# EAGLE design Display (EAGLE 7.1.0)
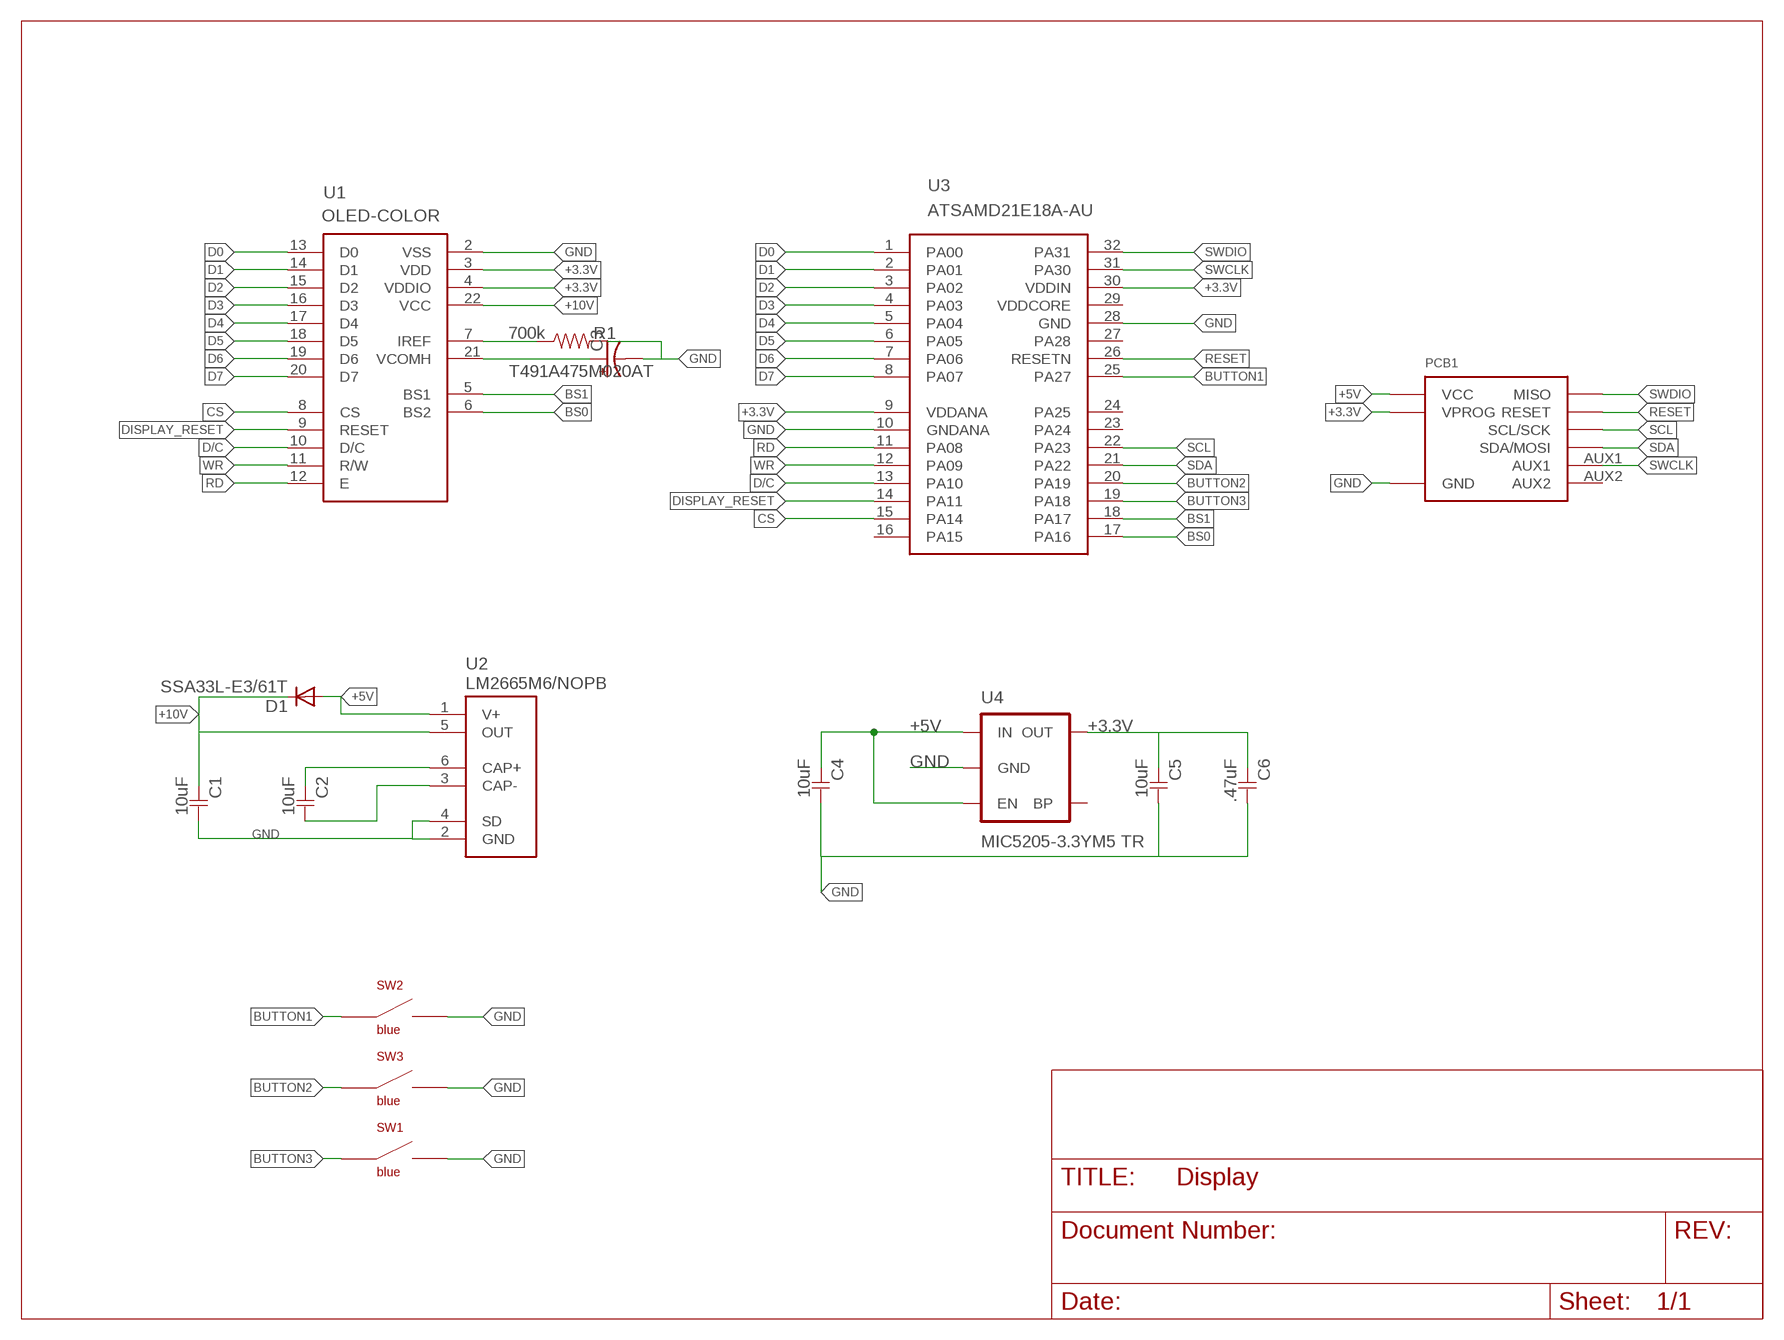
[diagram p0: schematic, sheet 1]

## Parts
C1  10uF  CAPACITOR  [0805]
C2  10uF  CAPACITOR  [0805]
C3  T491A475M020AT  10UF-16V-10%(TANT)  [EIA3216]
C4  10uF  CAPACITOR  [0805]
C5  10uF  CAPACITOR  [0805]
C6  .47uF  CAPACITOR  [0805]
D1  SSA33L-E3/61T  DIODESMA  [SMA-DIODE]
PCB1  MAGDEVICE-V2-OLED  [MAGDEVICE-V2-OLED]
R1  700k  RESISTOR  [0805]
SW1  blue  SWITCHBOURNS-7914J  [BOURNS-7914J]
SW2  blue  SWITCHBOURNS-7914J  [BOURNS-7914J]
SW3  blue  SWITCHBOURNS-7914J  [BOURNS-7914J]
U1  OLED-COLOR  [FPC-24]
U2  LM2665M6/NOPB  LM2665  [SOT-26]
U3  ATSAMD21E18A-AU  SAMD21E  [TQFP-32]
U4  MIC5205-3.3YM5 TR  VREG-MIC5205-3.3V  [SOT23-5]

## Nets
+3.3V: C5.1 C6.1 PCB1.VPROG U1.3(VDD) U1.4(VDDIO) U3.9(VDDANA) U3.30(VDDIN) U4.5(OUT)
+5V: C4.1 D1.A PCB1.VCC U2.1(V+) U4.1(IN) U4.3(EN)
+10V: C1.1 D1.C U1.22(VCC) U2.5(OUT)
BS0: U1.6(BS2) U3.17(PA16)
BS1: U1.5(BS1) U3.18(PA17)
BUTTON1: SW2.POS$1(POS1) SW2.POS$2(POS1) U3.25(PA27)
BUTTON2: SW3.POS$1(POS1) SW3.POS$2(POS1) U3.20(PA19)
BUTTON3: SW1.POS$1(POS1) SW1.POS$2(POS1) U3.19(PA18)
CS: U1.8(CS) U3.15(PA14)
D0: U1.13(D0) U3.1(PA00)
D1: U1.14(D1) U3.2(PA01)
D2: U1.15(D2) U3.3(PA02)
D3: U1.16(D3) U3.4(PA03)
D4: U1.17(D4) U3.5(PA04)
D5: U1.18(D5) U3.6(PA05)
D6: U1.19(D6) U3.7(PA06)
D7: U1.20(D7) U3.8(PA07)
D/C: U1.10(D/C) U3.13(PA10)
DISPLAY_RESET: U1.9(RESET) U3.14(PA11)
GND: C1.2 C3.C(-) C4.2 C5.2 C6.2 PCB1.GND R1.2 SW1.NEG$1(NEG1) SW1.NEG$2(NEG1) SW2.NEG$1(NEG1) SW2.NEG$2(NEG1) SW3.NEG$1(NEG1) SW3.NEG$2(NEG1) U1.2(VSS) U2.2(GND) U2.4(SD) U3.10(GNDANA) U3.28(GND) U4.2(GND)
N$5: C3.A(+) U1.21(VCOMH)
N$8: R1.1 U1.7(IREF)
N$13: C2.1 U2.6(CAP+)
N$14: C2.2 U2.3(CAP-)
RD: U1.12(E) U3.11(PA08)
RESET: PCB1.RESET U3.26(RESETN)
SCL: PCB1.SCL(SCL/SCK) U3.22(PA23)
SDA: PCB1.SDA(SDA/MOSI) U3.21(PA22)
SWCLK: PCB1.AUX1 U3.31(PA30)
SWDIO: PCB1.MISO U3.32(PA31)
WR: U1.11(R/W) U3.12(PA09)
Unconnected: PCB1.AUX2 U3.16(PA15) U3.23(PA24) U3.24(PA25) U3.27(PA28) U3.29(VDDCORE) U4.4(BP)

## Library data of the parts
C1 C2 C4-C6 = Modulo:CAPACITOR: Capacitor
C3 = SparkFun-Capacitors:10UF-16V-10%(TANT): CAP-00811 1206/EIA-3216 Tantalum capacitor; PROD_ID: CAP-00811; VALUE: 10uF
D1 = SparkFun-DiscreteSemi:DIODE: Diode These are standard reverse protection diodes and small signal diodes. SMA package can handle up to about 1A. SOD-323 can handle about 200mA. What the SOD-323 package when ordering, there are some mfgs out there that are 5-pin packages.
PCB1 = Modulo:MAGDEVICE; BOARD: Display; VERSION: 2
R1 = Modulo:RESISTOR: Resistor Basic schematic elements and footprints for 0603, 1206, and PTH resistors.
SW1-SW3 = Modulo:SWITCH; PARTNUM: 7914J-1-000E
U1 = Modulo:OLED-COLOR; SUPPLIER: buydisplay.com
U2 = Modulo:LM2665
U3 = Modulo:SAMD21E
U4 = Modulo:VREG-MIC5205: V_REG MIC5219 Standard 3.3V and 5V 150mA LDO voltage regulator in SOT-23 layout. Micrel part MIC5205. BP (by-pass) pin is used to lower output noise with 470pF cap, may be left open.

## Board
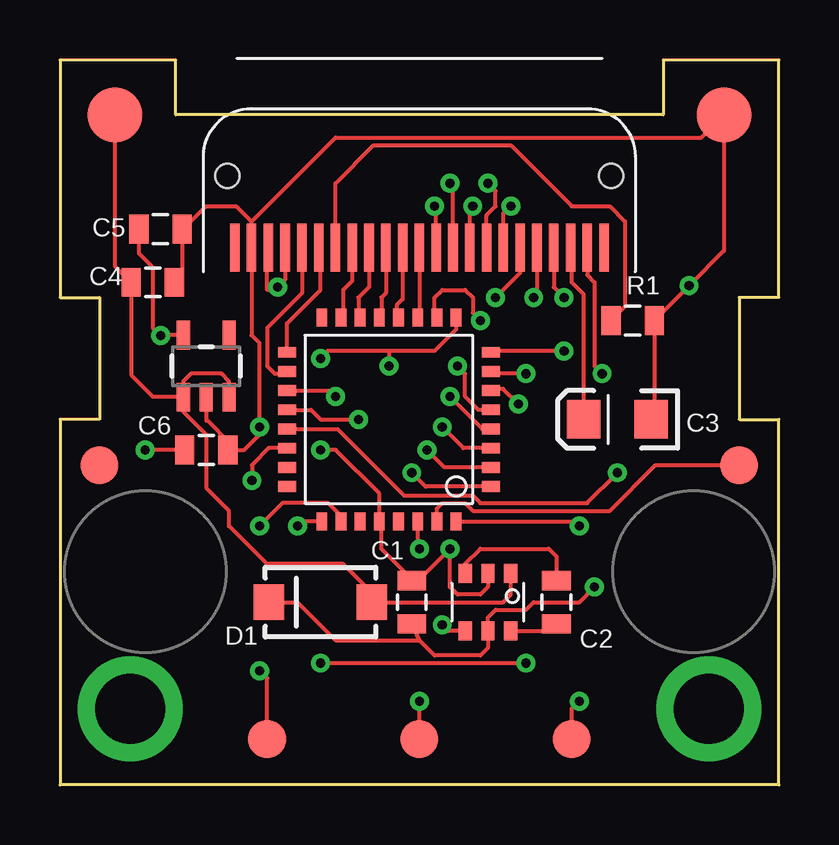
[diagram p1: board, top side]
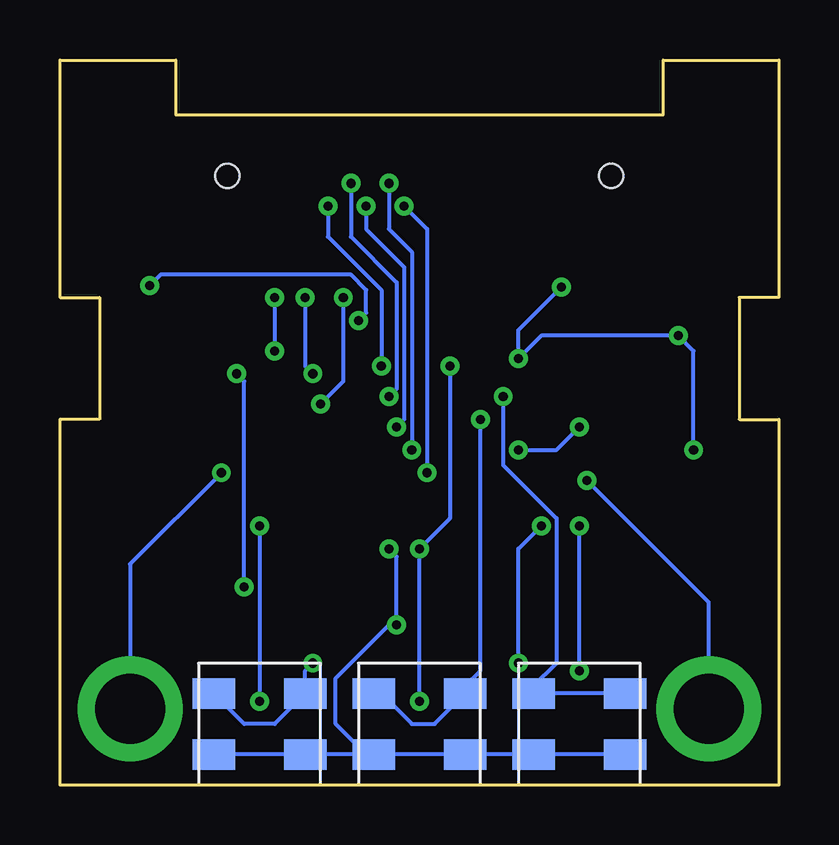
[diagram p2: board, bottom side, seen from below]

Size 29.97 x 30.23 mm. Coordinates in mm from the lower left corner, seen from the top.
Copper layers (1*16): Top 0.0178mm / dielectric 59mil / Bottom 0.0178mm
Design rules "SSC-EAGLE-2Lyr_v1.0.0.3": minimum track width 6mil, minimum drill 14mil, track to track 6mil, track to pad 6mil, pad to pad 6mil, via to via 6mil, smd to smd 6mil, copper to edge 20mil, drill to drill 16mil, minimum pad ring 8mil, minimum via ring 8mil, stop-mask expansion 3mil, vias tented up to drill 0mil, thermal gap 10mil

### Footprints (pad centres in the part's own frame; a part is rotated, then mirrored left to right if it is on the bottom)
0805 = smd 0.8 x 1.2: 1 -0.9,0; 2 0.9,0
EIA3216 = smd 1.4 x 1.6: A 1.4,0; C -1.4,0
SMA-DIODE = smd 1.27 x 1.47: A -2.15,0; C 2.15,0
MAGDEVICE-V2-OLED = smd 1.587 x 1.587 bottom: AUX1 1.905,13.335; AUX2 28.575,13.335; MISO 8.89,1.905; RESET 21.59,1.905; VPROG 15.24,1.905 | smd 2.286 x 2.286 bottom: GND 2.54,27.94; VCC 27.94,27.94 | drill 2.921: SCL 27.305,3.175; SDA 3.175,3.175
BOURNS-7914J = smd 1.27 x 1.778: NEG$1 1.27,1.905; NEG$2 1.27,-1.905; POS$1 -1.27,1.905; POS$2 -1.27,-1.905
FPC-24 = smd 0.4 x 2: 1 -7.7,1; 2 -7,1; 3 -6.3,1; 4 -5.6,1; 5 -4.9,1; 6 -4.2,1; 7 -3.5,1; 8 -2.8,1; 9 -2.1,1; 10 -1.4,1; 11 -0.7,1; 12 0,1; 13 0.7,1; 14 1.4,1; 15 2.1,1; 16 2.8,1; 17 3.5,1; 18 4.2,1; 19 4.9,1; 20 5.6,1; 21 6.3,1; 22 7,1; 23 7.7,1 | hole 1: -8,4; 8,4
SOT-26 = smd 0.55 x 0.8: 1 -0.95,-1.2; 2 0,-1.2; 3 0.95,-1.2; 4 0.95,1.2; 5 0,1.2; 6 -0.95,1.2
TQFP-32 = smd 0.75 x 0.45: 1 -4.25,2.8; 2 -4.25,2; 3 -4.25,1.2; 4 -4.25,0.4; 5 -4.25,-0.4; 6 -4.25,-1.2; 7 -4.25,-2; 8 -4.25,-2.8; 17 4.25,-2.8; 18 4.25,-2; 19 4.25,-1.2; 20 4.25,-0.4; 21 4.25,0.4; 22 4.25,1.2; 23 4.25,2; 24 4.25,2.8 | smd 0.45 x 0.75: 9 -2.8,-4.25; 10 -2,-4.25; 11 -1.2,-4.25; 12 -0.4,-4.25; 13 0.4,-4.25; 14 1.2,-4.25; 15 2,-4.25; 16 2.8,-4.25; 25 2.8,4.25; 26 2,4.25; 27 1.2,4.25; 28 0.4,4.25; 29 -0.4,4.25; 30 -1.2,4.25; 31 -2,4.25; 32 -2.8,4.25
SOT23-5 = smd 0.55 x 1.2: 1 -0.95,-1.3; 2 0,-1.3; 3 0.95,-1.3; 4 0.95,1.3; 5 -0.95,1.3

### Placement (x,y rotation side)
C1  14.67,7.62 90 top
C2  20.7,7.62 90 top
C3  23.24,15.24 180 top
C4  3.87,20.95 0 top
C5  4.19,23.18 0 top
C6  6.1,13.97 0 top
D1  10.86,7.62 180 top
PCB1  30.23,0 0 bottom
R1  23.88,19.37 0 top
SW1  8.32,2.54 270 bottom
SW2  21.65,2.54 270 bottom
SW3  14.99,2.54 270 bottom
U1  14.99,21.4 0 top
U2  17.84,7.62 180 top
U3  13.72,15.24 180 top
U4  6.1,17.46 0 top

### Tracks (layer width: path | path; a pad name or v marks a point on that pad's centre or on a via)
+3.3V  (via drill 0.38)
  Top 0.159: U1.4 9.39,21.07 v9.07,20.75 8.95,20.64 8.64,20.64 8.64,22.35 U1.3 | U3.9 16.52,18.99 15.62,18.1 13.72,18.1 | 13.72,18.1 11.18,18.1 v10.86,17.78 | U4.5 4.22,18.76 v4.19,18.73 3.87,19.05 3.87,21.59 3.29,22.17 C5.1 | C6.1 v3.56,13.97 | PCB1.VPROG v14.99,3.49 | U3.30 14.92,9.91 v14.99,9.84 | 13.72,18.1 v13.72,17.46
  Bottom 0.159: v9.07,20.75 10.86,18.96 v10.86,17.78 9.91,18.73 v4.19,18.73 3.56,18.1 v3.56,13.97 | v14.99,3.49 v14.99,9.84 13.72,11.11 v13.72,17.46
+5V
  Top 0.159: PCB1.VCC 2.29,21.64 C4.1 2.97,17.09 3.87,16.19 5.12,16.19 U4.1 | U4.3 7.05,16.83 6.73,17.14 5.46,17.14 5.14,16.83 U4.1 | U4.1 5.15,15.55 6.1,14.61 6.1,12.38 7.05,11.43 7.05,10.79 8.64,9.21 11.81,9.21 13.01,8.01 D1.A 18.48,7.62 18.8,7.94 U2.1
+10V  (via drill 0.38)
  Top 0.159: U1.22 21.99,21.26 22.29,20.95 22.29,17.46 v22.61,17.14 | 14.99,6.03 15.62,5.4 17.53,5.4 17.84,5.71 U2.5 17.84,6.99 18.16,7.3 19.43,7.3 19.75,7.62 21.65,7.62 v22.29,8.26 | 14.99,6.03 C1.1 | D1.C 9.91,7.62 11.49,6.03 14.99,6.03
  Bottom 0.159: v22.29,8.26 22.29,16.83 v22.61,17.14
BS0
  Top 0.159: U3.17 9.47,19.25 10.86,20.64 10.86,22.33 U1.6
BS1
  Top 0.159: U1.5 10.09,20.5 8.64,19.05 8.64,17.46 8.95,17.14 9.37,17.14 U3.18
BUTTON1  (via drill 0.38)
  Top 0.159: v19.43,5.08 v10.86,5.08 | U3.25 10.1,10.99 v9.91,10.79
  Bottom 0.159: SW2.POS$2 22.29,2.54 21.02,2.54 SW2.POS$1 19.75,4.76 v19.43,5.08 | v10.86,5.08 10.86,9.84 v9.91,10.79
BUTTON2  (via drill 0.38)
  Top 0.159: U3.20 10.46,15.64 10.86,15.24 v12.45,15.24
  Bottom 0.159: v12.45,15.24 12.45,4.76 13.08,4.13 SW3.POS$1 14.35,2.54 15.3,2.54 16.57,3.81 SW3.POS$2
BUTTON3  (via drill 0.38)
  Top 0.159: U3.19 11.25,16.44 v11.49,16.19
  Bottom 0.159: SW1.POS$1 SW1.POS$2 10.22,4.13 9.27,5.08 9.27,11.11 11.49,13.34 v11.49,16.19
CS
  Top 0.159: U1.8 12.19,21.01 11.81,20.64 11.81,19.59 U3.15
D0  (via drill 0.38)
  Top 0.159: U1.13 15.69,24.07 v15.62,24.13 | U3.1 15.25,12.44 v14.67,13.02
  Bottom 0.159: v15.62,24.13 14.67,23.18 v14.67,13.02
D1  (via drill 0.38)
  Top 0.159: U1.14 16.39,24.95 v16.26,25.08 | U3.2 16.03,13.24 v15.3,13.97
  Bottom 0.159: v16.26,25.08 16.26,23.18 15.3,22.23 v15.3,13.97
D2  (via drill 0.38)
  Top 0.159: U1.15 17.09,24.01 v17.21,24.13 | U3.3 16.82,14.04 v15.94,14.92
  Bottom 0.159: v17.21,24.13 17.21,23.18 15.62,21.59 15.62,15.24 v15.94,14.92
D3  (via drill 0.38)
  Top 0.159: U1.16 17.79,23.75 18.16,24.13 18.16,24.77 v17.84,25.08 | U3.4 17.61,14.84 v16.26,16.19
  Bottom 0.159: v17.84,25.08 17.84,22.86 15.94,20.95 15.94,16.51 v16.26,16.19
D4  (via drill 0.38)
  Top 0.159: U1.17 18.49,23.82 v18.8,24.13 | U3.5 17.44,15.64 16.89,16.19 16.89,17.14 v16.57,17.46
  Bottom 0.159: v18.8,24.13 18.8,22.86 16.57,20.64 v16.57,17.46
D5  (via drill 0.38)
  Top 0.159: U1.18 19.19,21.34 v18.16,20.32 | v19.11,15.88 18.48,16.51 18.04,16.51 U3.6
  Bottom 0.159: v18.16,20.32 18.16,16.83 v19.11,15.88
D6  (via drill 0.38)
  Top 0.159: U1.19 19.89,20.46 v19.75,20.32 | v19.43,17.14 18.06,17.14 U3.7
  Bottom 0.159: v19.75,20.32 19.75,17.46 v19.43,17.14
D7  (via drill 0.38)
  Top 0.159: U1.20 20.59,20.75 v21.02,20.32 | v21.02,18.1 18.02,18.1 U3.8
  Bottom 0.159: v21.02,20.32 v21.02,18.1
D/C
  Top 0.159: U1.10 13.59,20.51 13.4,20.32 13.4,19.57 U3.13
DISPLAY_RESET
  Top 0.159: U1.9 12.89,20.76 12.45,20.32 12.45,19.56 U3.14
GND  (via drill 0.38)
  Top 0.159: U3.10 15.62,19.39 15.62,20.32 15.94,20.64 16.89,20.64 17.21,20.32 17.21,19.68 v17.53,19.37 | C3.C 24.78,15.38 R1.2 v26.23,20.82 27.69,22.28 PCB1.GND 26.73,26.99 11.49,26.99 7.99,23.48 | 7.99,23.48 U1.2 7.99,18.75 8.32,18.41 v8.32,14.92 8.32,14.61 7.68,13.97 C6.2 7.05,14.29 6.15,15.19 6.1,15.19 U4.2 | C4.2 5.09,21.27 C5.2 5.14,23.18 6.1,24.13 7.34,24.13 7.99,23.48 | C1.2 14.99,8.57 | 14.99,8.57 v16.26,9.84 16.26,8.26 16.57,7.94 17.53,7.94 17.84,8.26 U2.2 | U2.4 16.19,6.42 v15.94,6.67 | 14.99,8.57 14.67,8.57 13.4,9.84 13.4,10.91 U3.28 13.32,12.15 11.49,13.97 v10.86,13.97
  Bottom 0.159: SW1.NEG$1 SW1.NEG$2 SW3.NEG$1 SW3.NEG$2 | SW3.NEG$2 SW2.NEG$1 SW2.NEG$2 24.19,1.27 | SW3.NEG$2 17.21,1.27 18.48,2.54 18.48,4.45 16.26,6.67 v15.94,6.67 15.94,9.53 v16.26,9.84 | v17.53,19.37 17.21,19.68 17.21,20.64 17.84,21.27 25.78,21.27 v26.23,20.82 | v10.86,13.97 9.27,13.97 v8.32,14.92
N$5
  Top 0.159: C3.A 21.84,20.45 21.34,20.95 21.34,22.35 U1.21
N$8
  Top 0.159: U1.7 11.49,25.07 13.08,26.67 18.8,26.67 21.34,24.13 22.92,24.13 23.56,23.5 23.56,19.95 R1.1
N$13
  Top 0.159: U2.6 20.4,6.42 C2.1
N$14
  Top 0.159: U2.3 16.89,9.21 17.53,9.84 20.38,9.84 20.7,9.53 C2.2
RD
  Top 0.159: U1.12 14.99,19.56 U3.11
RESET  (via drill 0.38)
  Top 0.159: PCB1.RESET 8.64,4.45 v8.32,4.76 | U3.26 11.72,11.21 11.18,11.75 9.27,11.75 v8.32,10.79
  Bottom 0.159: v8.32,4.76 v8.32,10.79
SCL  (via drill 0.38)
  Top 0.159: U3.22 8.71,14.04 8,13.34 v8,12.7
  Bottom 0.159: PCB1.SCL 2.92,7.62 v8,12.7
SDA  (via drill 0.38)
  Top 0.159: U3.21 11.58,14.84 14.35,12.06 17.21,12.06 17.53,11.75 21.97,11.75 v23.24,13.02
  Bottom 0.159: v23.24,13.02 27.05,9.21 PCB1.SDA
SWCLK
  Top 0.159: U3.31 15.72,11.53 15.94,11.75 16.89,11.75 17.21,11.43 22.92,11.43 24.83,13.34 PCB1.AUX1
SWDIO  (via drill 0.38)
  Top 0.159: U3.32 21.46,10.99 v21.65,10.79 | PCB1.MISO 21.34,3.17 v21.65,3.49
  Bottom 0.159: v21.65,10.79 v21.65,3.49
WR
  Top 0.159: U1.11 14.29,20.25 14.03,20 14.03,19.57 U3.12